# Altium schematic sheet CPU.SchDoc
size A; SheetNumber: 1; SheetTotal: 5
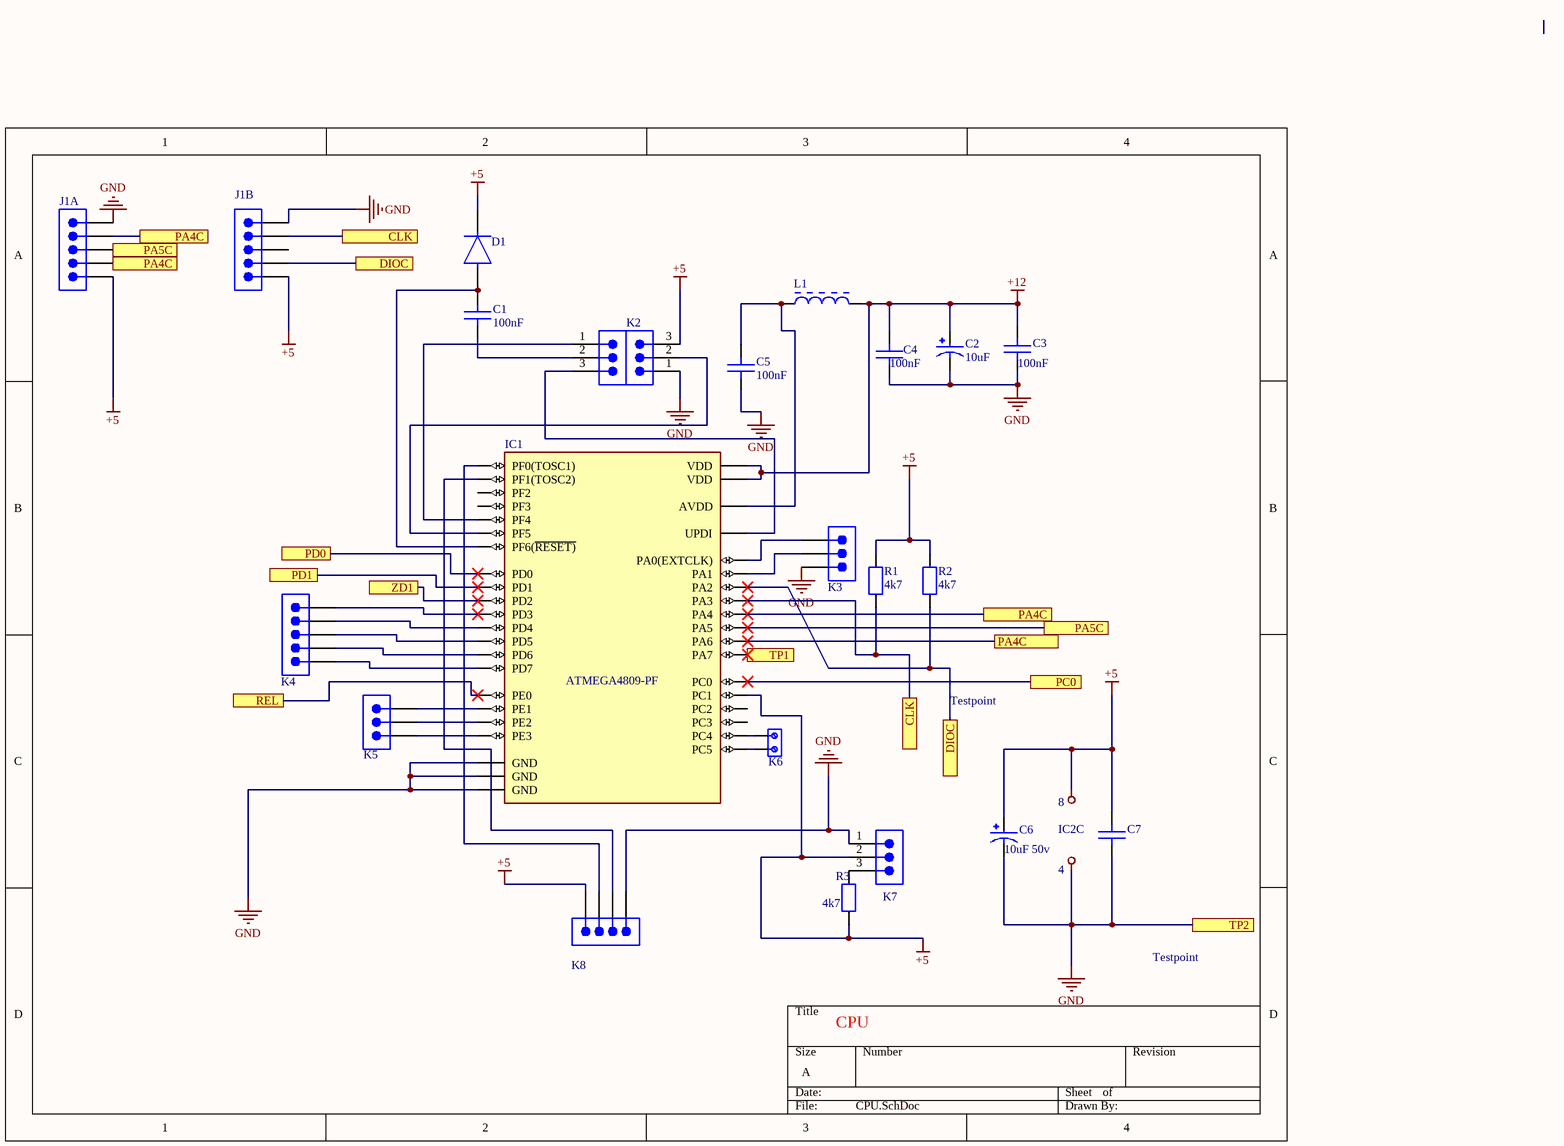
[diagram p0: CPU.SchDoc]

## Parts
C1  100nF  [CAP_0805]
C2  10uF  [CAPPRD350W60D800H1150]
C3  100nF  [CAP_0805]
C4  100nF  [CAP_0805]
C5  100nF  [CAP_0805]
C6  10uF 50v  [CAPPRD500W50D500H1100]
C7  CAP_0805  [CAP_0805]  (value not drawn)
D1  1N4148WSF-7  [FP-SOD323F-MFG]  (value not drawn)
IC1  ATMEGA4809-PF  [FP-C04-016-MFG]
J1A  61300511121  [61300511121]  (value not drawn)
J1B  61300511121  [61300511121]  (value not drawn)
K1  61300311121  [61300311121]  (value not drawn)
K2  61300311121  [61300311121]  (value not drawn)
K3  61300311121  [61300311121]  (value not drawn)
K4  61300511121  [61300511121]  (value not drawn)
K5  61300311121  [61300311121]  (value not drawn)
K6  connecters 2pins  [conncecto 2 pins]  (value not drawn)
K7  61300311121  [61300311121]  (value not drawn)
K8  61300411121  [61300411121]  (value not drawn)
L1  RFB0807-103L  [COIL-RFB0807-2_V]  (value not drawn)
R1  4k7  [RES_0805]
R2  4k7  [RES_0805]
R3  4k7  [RES_0805]

## Ports
CLK, DIOC, PA4C, PA5C, PC0, PD0, PD1, REL, TP1, TP2, ZD1

## Nets
+5: C2.N C3.1 C4.1 C5.1 C6.N C6.P C7.1 C7.2 D1.1(C) IC1.2(PC1) IC1.6(GND) IC1.18(GND) IC1.32(GND) J1A.1 J1A.5 J1B.1 J1B.5 K2.1 K2.3 K3.1 K7.1 K7.2 K8.1 K8.4 R1.2 R2.2 R3.1 ; port TP2  [also labelled GND]
+12: C2.P C3.2 C4.2 IC1.5(VDD) IC1.31(VDD) L1.2
CLK: IC1.36(PA3) J1B.4 R1.1 ; port CLK
DIOC: IC1.35(PA2) J1B.2 R2.1 ; port DIOC
PA4C: IC1.37(PA4) IC1.39(PA6) J1A.2 J1A.4 ; port PA4C
PA5C: IC1.38(PA5) J1A.3 ; port PA5C
PC0: IC1.1(PC0) ; port PC0
PD0: IC1.9(PD0) ; port PD0
PD1: IC1.10(PD1) ; port PD1
REL: IC1.19(PE0) ; port REL
TP1: IC1.40(PA7) ; port TP1
ZD1: IC1.11(PD2) ; port ZD1
NetC1_1: C1.1 K1.2
NetC1_2: C1.2 D1.2(A) IC1.29(PF6(~{RESET)})
NetC5_2: C5.2 IC1.17(AVDD) L1.1
NetIC1_7: IC1.7(PC4) K6.1
NetIC1_8: IC1.8(PC5) K6.2
NetIC1_12: IC1.12(PD3) K4.5
NetIC1_13: IC1.13(PD4) K4.4
NetIC1_14: IC1.14(PD5) K4.3
NetIC1_15: IC1.15(PD6) K4.2
NetIC1_16: IC1.16(PD7) K4.1
NetIC1_20: IC1.20(PE1) K5.1
NetIC1_21: IC1.21(PE2) K5.2
NetIC1_22: IC1.22(PE3) K5.3
NetIC1_23: IC1.23(PF0(TOSC1)) K8.3
NetIC1_24: IC1.24(PF1(TOSC2)) K8.2
NetIC1_27: IC1.27(PF4) K1.1
NetIC1_28: IC1.28(PF5) K2.2
NetIC1_30: IC1.30(UPDI) K1.3
NetIC1_33: IC1.33(PA0(EXTCLK)) K3.3
NetIC1_34: IC1.34(PA1) K3.2
NetK7_3: K7.3 R3.2

Not connected (* = marked no-connect by the designer): IC1 3(PC2) 4(PC3) 25(PF2) 26(PF3); J1B 3

## Notes on the sheet
- Testpoint
- 8
- (near C7) IC2C
- 4
- CPU

## Library data of the parts
C1 C3-C5 C7 = CAP_0805: Capacitor SMD 0805 generic.; Manufacturer: *; Manufacture Part N: *; Tolerence: *; Voltage Rating: *; Dielectric: *
C2 = Capacitor: Capacitor 100 μF, 50 V, steek 3,5 mm, 8x11 mm, generic.
C6 = Capacitor_1: Capacitor, 10 μF, 50 V, steek 2 mm, 5x11 mm, generic.
D1 = 1N4148WSF-7: Rectifier Diode, 1 Phase, 1 Element, 0.25A, 100V V(RRM), Silicon; Manufacturer: Diodes; Package Body Material: Plastic; Number of Elements: 1; Max Output current: 250mA; Max Power Dissipation: 400mW; Reverse Recovery Time-Max: 0.004us; Supplier: Future Electronics; Supplier Part Number: 4050038; Manufacturer Part Number: 1N4148WSF-7; RoHS: Yes; Category: Rectifier Diodes; Stock: 36000; Pricing: 3000=0.0178, 12000=0.0171, 45000=0.0164, 90000=0.0161, 225000=0.0153 (USD); Pins: 2; Diode Element Material: SILICON; Package Shape: Rectangular; Terminal Finish: Tin; Min Operating Temperature: -55°C; Max Operating Temperature: 150°C; JESD-609 Code: e3; Diode Type: RECTIFIER; JESD-30 Code: R-PDSO-F2; Package Style: SMALL OUTLINEMeter; Rep Pk Reverse Voltage-Max: 100V; Surface Mount: Yes; Terminal Form: Flat; Terminal Position: DUAL; Reach SVHC Compliant: Yes; RoHS Compliant: Yes; ComponentLink1URL: https://datasheet.ciiva.com:443/pdfs/VipMasterIC/IC/DIOD/DIODS20288/DIODS20288-1.pdf?src-supplier=IHS+Markit; ComponentLink1Description: https://datasheet.ciiva.com:443/pdfs/VipMasterIC/IC/DIOD/DIODS20288/DIODS20288-1.pdf?src-supplier=IHS+Markit; ComponentLink2URL: https://datasheet.ciiva.com/29592/1n4148wsf-29592065.pdf?src-supplier=Digikey; ComponentLink2Description: https://datasheet.ciiva.com/29592/1n4148wsf-29592065.pdf?src-supplier=Digikey
J1A J1B K4 = 61300511121: Board Connector, 5 Contact(s), 1 Row(s), Male, Straight, 0.1 inch Pitch, Solder Terminal, Locking, Black Insulator, Plug; Manufacturer: Wurth Electronics; Contact Pattern: RECTANGULAR; Contact Resistance: 20mR; Contact Style: SQ PIN-SKT; Dielectric Withstanding Voltage (AC): 500V; Insulation Resistance: 1GR; Number Of Connectors: 1; Rated Current (Signal): 3A; Number of Contacts: 5; Body Length: 0.5inch; Reference Standard: UL; Reliability: COMMERCIAL; Supplier: Rs; Supplier Part Number: 8281597P; Manufacturer Part Number: 61300511121; RoHS: Yes; Category: Headers and Wire Housings; Stock: 1085; Pricing: 125=0.136, 500=0.116, 2500=0.11, 5000=0.102 (EUR); Mounting Technology: Board; Contact Material: Copper Alloy; Contact Finish - Mating: GOLD; Contact Finish - Termination: Gold (Au) - with Nickel (Ni) barrier; Insulation Color: Black; Insulation Material: Polybutylene; Min Operating Temperature: -40°C; Max Operating Temperature: 125°C; Connector Type: BOARD CONNECTOR; JESD-609 Code: e4; Body/Shell Style: PLUG; Contact Gender: Male; Mounting Style: STRAIGHT; Number of Rows Loaded: 1; PCB Contact Pattern: RECTANGULAR; Termination: Solder; Body Breadth: 0.1inch; Body Depth: 0.1inch; Mating Contact Pitch: 0.1inch; Mounting Option 1: LOCKING; Terminal Length: 0.118inch; Terminal Pitch: 2.54mm; Reach SVHC Compliant: Yes; RoHS Compliant: Yes; ComponentLink1URL: https://datasheet.ciiva.com:443/pdfs/VipMasterIC/IC/MIDC/MIDCS07676/MIDCS07676-1.pdf?src-supplier=IHS+Markit; ComponentLink1Description: https://datasheet.ciiva.com:443/pdfs/VipMasterIC/IC/MIDC/MIDCS07676/MIDCS07676-1.pdf?src-supplier=IHS+Markit; ComponentLink2URL: http://www.farnell.com/cad/1737268.pdf?src-supplier=Element14; ComponentLink2Description: http://www.farnell.com/cad/1737268.pdf?src-supplier=Element14; ComponentLink3URL: https://datasheet.octopart.com/61300511121-W%C3%BCrth-Elektronik-datasheet-21154836.pdf?src-supplier=Element14; ComponentLink3Description: https://datasheet.octopart.com/61300511121-W%C3%BCrth-Elektronik-datasheet-21154836.pdf?src-supplier=Element14; ComponentLink4URL: https://katalog.we-online.de/em/datasheet/6130xx11121.pdf?src-supplier=Digikey; ComponentLink4Description: https://katalog.we-online.de/em/datasheet/6130xx11121.pdf?src-supplier=Digikey
K1-K3 K5 K7 = 61300311121: Board Connector, 3 Contact(s), 1 Row(s), Male, Straight, 0.1 inch Pitch, Solder Terminal, Locking, Black Insulator, Plug; Manufacturer: Wurth Electronics; Contact Pattern: RECTANGULAR; Contact Resistance: 20mR; Contact Style: SQ PIN-SKT; Dielectric Withstanding Voltage (AC): 500V; Insulation Resistance: 1GR; Number Of Connectors: 1; Rated Current (Signal): 3A; Number of Contacts: 3; Body Length: 0.3inch; Reference Standard: UL; Reliability: COMMERCIAL; Supplier: Rs; Supplier Part Number: 8281585P; Manufacturer Part Number: 61300311121; RoHS: Yes; Category: Connectors; Stock: 3960; Pricing: 25=0.11, 50=0.088, 100=0.082, 250=0.078 (EUR); Mounting Technology: Board; Contact Material: Copper Alloy; Contact Finish - Mating: GOLD; Contact Finish - Termination: Gold (Au) - with Nickel (Ni) barrier; Insulation Color: Black; Insulation Material: Polybutylene; Min Operating Temperature: -40°C; Max Operating Temperature: 125°C; Connector Type: BOARD CONNECTOR; JESD-609 Code: e4; Body/Shell Style: PLUG; Contact Gender: Male; Mounting Style: STRAIGHT; Number of Rows Loaded: 1; PCB Contact Pattern: RECTANGULAR; Termination: Solder; Body Breadth: 0.1inch; Body Depth: 0.1inch; Mating Contact Pitch: 0.1inch; Mounting Option 1: LOCKING; Terminal Length: 0.118inch; Terminal Pitch: 2.54mm; Reach SVHC Compliant: Yes; RoHS Compliant: Yes; ComponentLink1URL: https://datasheet.ciiva.com:443/pdfs/VipMasterIC/IC/MIDC/MIDCS07676/MIDCS07676-1.pdf?src-supplier=IHS+Markit; ComponentLink1Description: https://datasheet.ciiva.com:443/pdfs/VipMasterIC/IC/MIDC/MIDCS07676/MIDCS07676-1.pdf?src-supplier=IHS+Markit; ComponentLink2URL: http://www.farnell.com/cad/1737268.pdf?src-supplier=Element14; ComponentLink2Description: http://www.farnell.com/cad/1737268.pdf?src-supplier=Element14; ComponentLink3URL: https://datasheet.octopart.com/61300311121-W%C3%BCrth-Elektronik-datasheet-21154836.pdf?src-supplier=Element14; ComponentLink3Description: https://datasheet.octopart.com/61300311121-W%C3%BCrth-Elektronik-datasheet-21154836.pdf?src-supplier=Element14; ComponentLink4URL: https://katalog.we-online.de/em/datasheet/6130xx11121.pdf?src-supplier=Digikey; ComponentLink4Description: https://katalog.we-online.de/em/datasheet/6130xx11121.pdf?src-supplier=Digikey
K6 = pins: printkroonsteen 5,08 mm,
K8 = 61300411121: Board Connector, 4 Contact(s), 1 Row(s), Male, Straight, 0.1 inch Pitch, Solder Terminal, Locking, Black Insulator, Plug; Manufacturer: Wurth Electronics; Contact Pattern: RECTANGULAR; Contact Resistance: 20mR; Contact Style: SQ PIN-SKT; Dielectric Withstanding Voltage (AC): 500V; Insulation Resistance: 1GR; Number Of Connectors: 1; Rated Current (Signal): 3A; Number of Contacts: 4; Body Length: 0.4inch; Reference Standard: UL; Reliability: COMMERCIAL; Supplier: Rs; Supplier Part Number: 8281594P; Manufacturer Part Number: 61300411121; RoHS: Yes; Category: Headers and Wire Housings; Stock: 2615; Pricing: 250=0.076, 500=0.074, 2500=0.072, 5000=0.07 (EUR); Mounting Technology: Board; Contact Material: Copper Alloy; Contact Finish - Mating: GOLD; Contact Finish - Termination: Gold (Au) - with Nickel (Ni) barrier; Insulation Color: Black; Insulation Material: Polybutylene; Min Operating Temperature: -40°C; Max Operating Temperature: 125°C; Connector Type: BOARD CONNECTOR; JESD-609 Code: e4; Body/Shell Style: PLUG; Contact Gender: Male; Mounting Style: STRAIGHT; Number of Rows Loaded: 1; PCB Contact Pattern: RECTANGULAR; Termination: Solder; Body Breadth: 0.1inch; Body Depth: 0.1inch; Mating Contact Pitch: 0.1inch; Mounting Option 1: LOCKING; Terminal Length: 0.118inch; Terminal Pitch: 2.54mm; Reach SVHC Compliant: Yes; RoHS Compliant: Yes; ComponentLink1URL: https://datasheet.ciiva.com:443/pdfs/VipMasterIC/IC/MIDC/MIDCS07676/MIDCS07676-1.pdf?src-supplier=IHS+Markit; ComponentLink1Description: https://datasheet.ciiva.com:443/pdfs/VipMasterIC/IC/MIDC/MIDCS07676/MIDCS07676-1.pdf?src-supplier=IHS+Markit; ComponentLink2URL: http://www.farnell.com/cad/1737268.pdf?src-supplier=Element14; ComponentLink2Description: http://www.farnell.com/cad/1737268.pdf?src-supplier=Element14; ComponentLink3URL: https://datasheet.octopart.com/61300411121-W%C3%BCrth-Elektronik-datasheet-21154836.pdf?src-supplier=Element14; ComponentLink3Description: https://datasheet.octopart.com/61300411121-W%C3%BCrth-Elektronik-datasheet-21154836.pdf?src-supplier=Element14; ComponentLink4URL: https://katalog.we-online.de/em/datasheet/6130xx11121.pdf?src-supplier=Digikey; ComponentLink4Description: https://katalog.we-online.de/em/datasheet/6130xx11121.pdf?src-supplier=Digikey
L1 = RFB0807-103L: General Purpose Inductor, 10000uH, 10%, 1 Element, Ferrite-Core; Manufacturer: Coilcraft; Manufacturer Series: RFB; DC Resistance (DCR): 34R; Inductor Application: POWER INDUCTOR; Channels: 1; Max Current Rating: 100mA; Self Resonant Frequency: 700kHz; Shape/Size Description: CYLINDRICAL PACKAGE; Shielding: Unshielded; Surface Mount: No; Test Frequency: 100kHz; Lead Diameter: 0.6mm; Lead Length: 4mm; Package Diameter: 8.8mm; Package Length: 7.5mm; Reference Standard: AEC-Q200; Supplier: Mouser; Supplier Part Number: 994-RFB0807-103L; Manufacturer Part Number: RFB0807-103L; RoHS: Yes; Category: Fixed Inductors; Stock: 337; Pricing: 1=1.46, 10=1.46, 50=1.46, 100=1.46, 1000=0.714, 10000=0.664 (USD); Pins: 2; Core Material: Ferrite; Terminal Finish: Tin; Min Operating Temperature: -40°C; Max Operating Temperature: 85°C; Tolerance: 10%; JESD-609 Code: e2; Construction: Cylindrical; Inductance-Nom (L): 10000uH; Inductor Type: GENERAL PURPOSE INDUCTOR; Package Style: RadialMeter; Packaging: Tray; Series: RFB; Terminal Placement: Radial; Termination: Wire; Lead Pitch: 5mm; Reach SVHC Compliant: Yes; RoHS Compliant: Yes; ComponentLink1URL: https://datasheet.ciiva.com:443/pdfs/VipMasterIC/IC/COLC/COLC-S-A0001039031/COLC-S-A0000243710-1.pdf?src-supplier=IHS+Markit; ComponentLink1Description: https://datasheet.ciiva.com:443/pdfs/VipMasterIC/IC/COLC/COLC-S-A0001039031/COLC-S-A0000243710-1.pdf?src-supplier=IHS+Markit; ComponentLink2URL: http://www.farnell.com/datasheets/1870388.pdf?src-supplier=Farnell; ComponentLink2Description: http://www.farnell.com/datasheets/1870388.pdf?src-supplier=Farnell; ComponentLink3URL: http://www.farnell.com/datasheets/1870388.pdf?src-supplier=Element14; ComponentLink3Description: http://www.farnell.com/datasheets/1870388.pdf?src-supplier=Element14
R1-R3 = RES_0805: SMD size 0805 Generic.; Manufacturer: *; Manufacture Part N: *; Tolerence: *; Package Size: *; Voltage Rating: *